# Altium schematic sheet fastDACs.SchDoc
size A; SheetNumber: 12; SheetTotal: 24
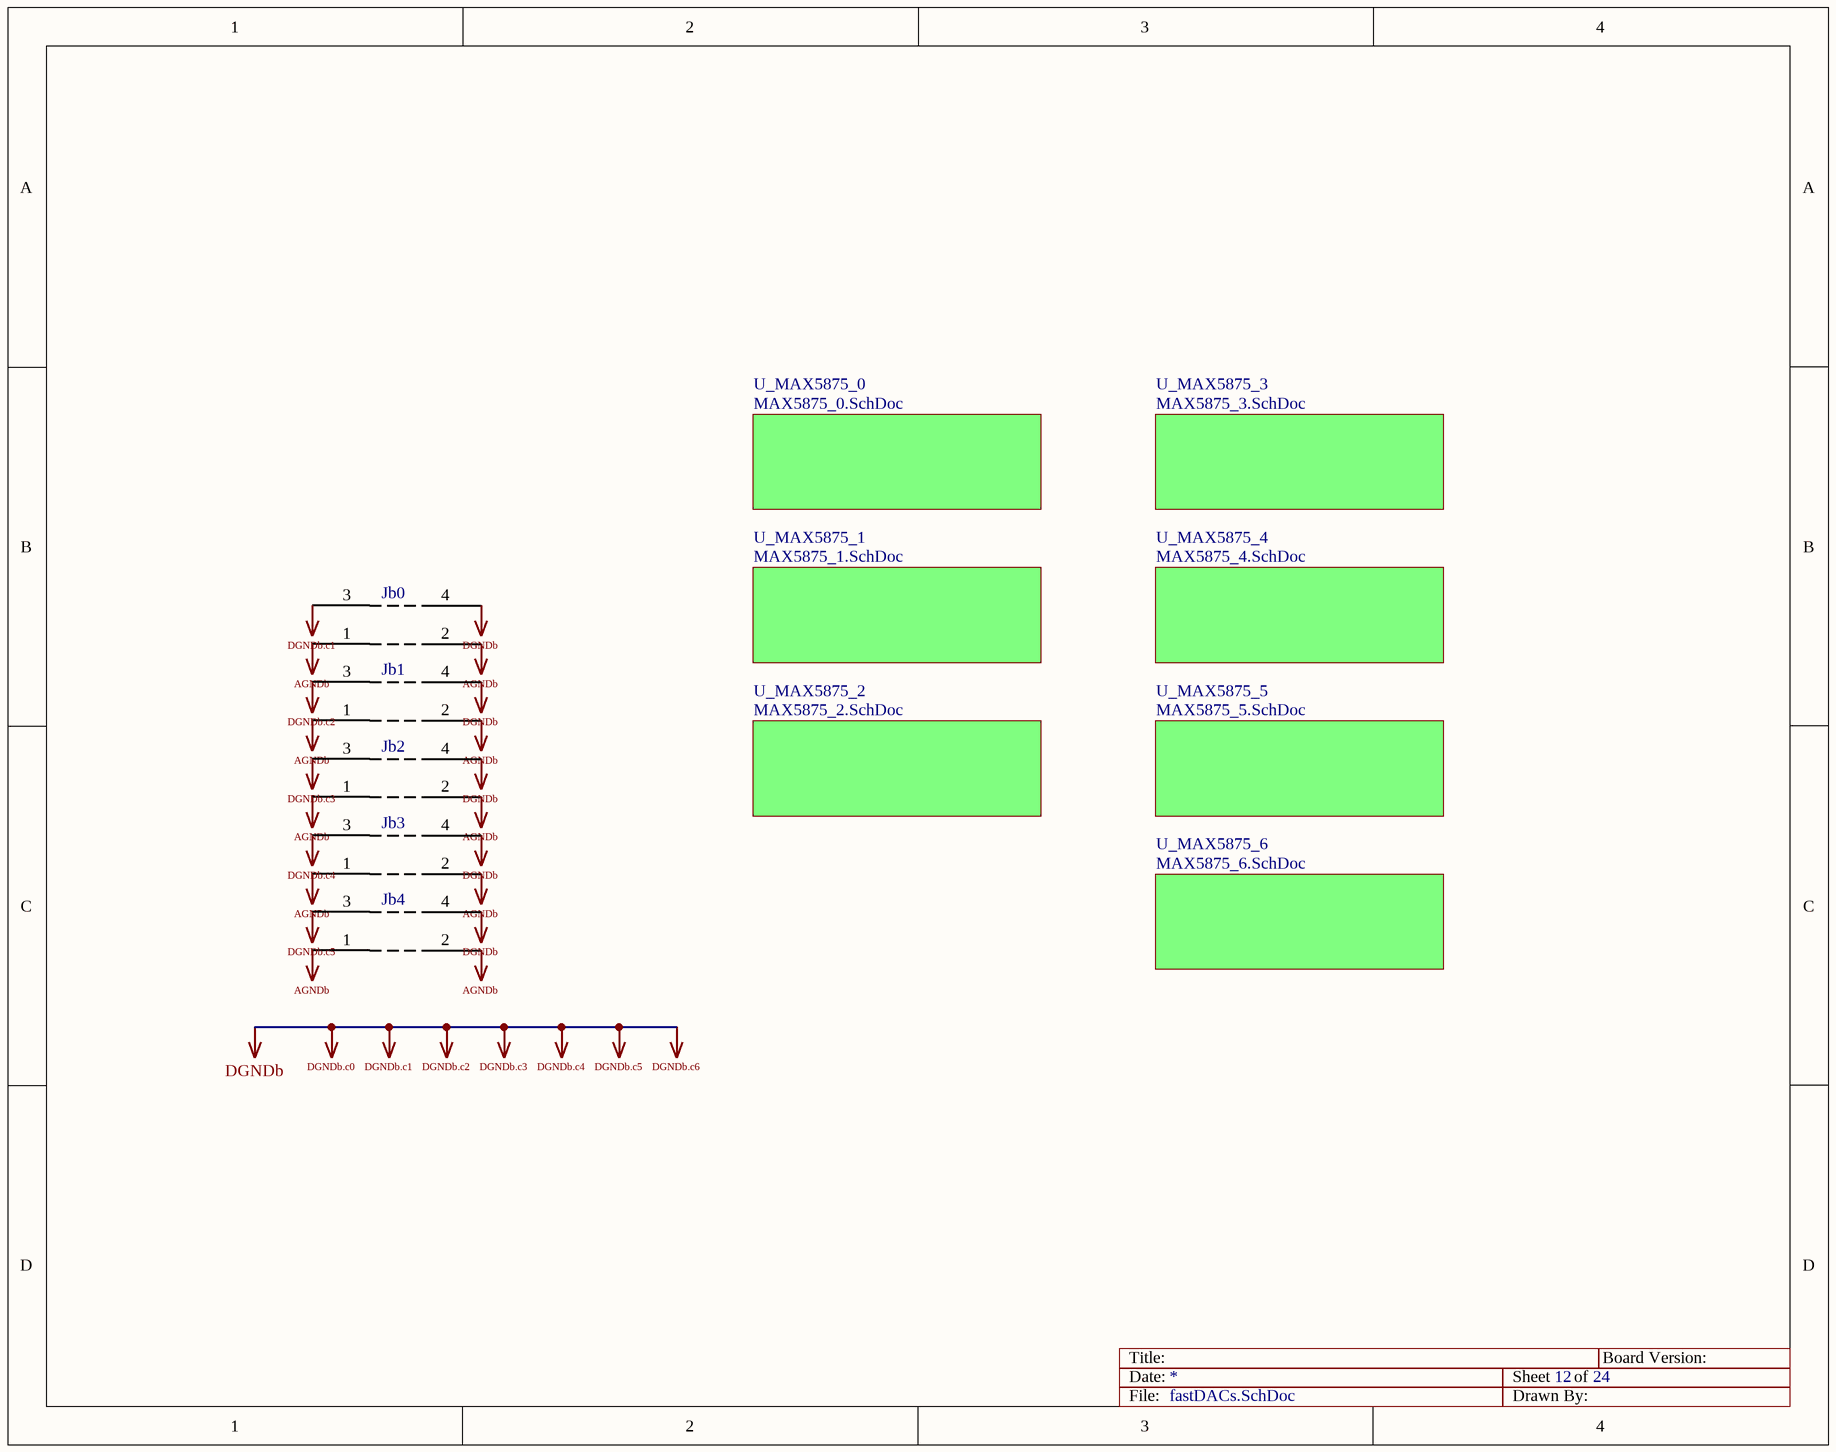
[diagram p0: fastDACs.SchDoc]

## Parts
Jb0  fDAC GND pads  [fDAC_GND_conn]  (value not drawn)
Jb1  fDAC GND pads  [fDAC_GND_conn]  (value not drawn)
Jb2  fDAC GND pads  [fDAC_GND_conn]  (value not drawn)
Jb3  fDAC GND pads  [fDAC_GND_conn]  (value not drawn)
Jb4  fDAC GND pads  [fDAC_GND_conn]  (value not drawn)

## Sub-sheets
U_MAX5875_0 = MAX5875_0.SchDoc: no entries
U_MAX5875_1 = MAX5875_1.SchDoc: no entries
U_MAX5875_2 = MAX5875_2.SchDoc: no entries
U_MAX5875_3 = MAX5875_3.SchDoc: no entries
U_MAX5875_4 = MAX5875_4.SchDoc: no entries
U_MAX5875_5 = MAX5875_5.SchDoc: no entries
U_MAX5875_6 = MAX5875_6.SchDoc: no entries

## Nets
AGNDb: Jb0.1 Jb0.2 Jb1.1 Jb1.2 Jb2.1 Jb2.2 Jb3.1 Jb3.2 Jb4.1 Jb4.2
DGNDb: Jb0.3 Jb0.4 Jb1.3 Jb1.4 Jb2.3 Jb2.4 Jb3.3 Jb3.4 Jb4.3 Jb4.4  [also labelled DGNDb.c0, DGNDb.c1, DGNDb.c2, DGNDb.c3, DGNDb.c4, DGNDb.c5, DGNDb.c6]

## Notes on the sheet
- Title:
- Date:
- Sheet
- of
- Board Version:
- File:
- Drawn By:

## Library data of the parts
Jb0-Jb4 = fADC GND pads